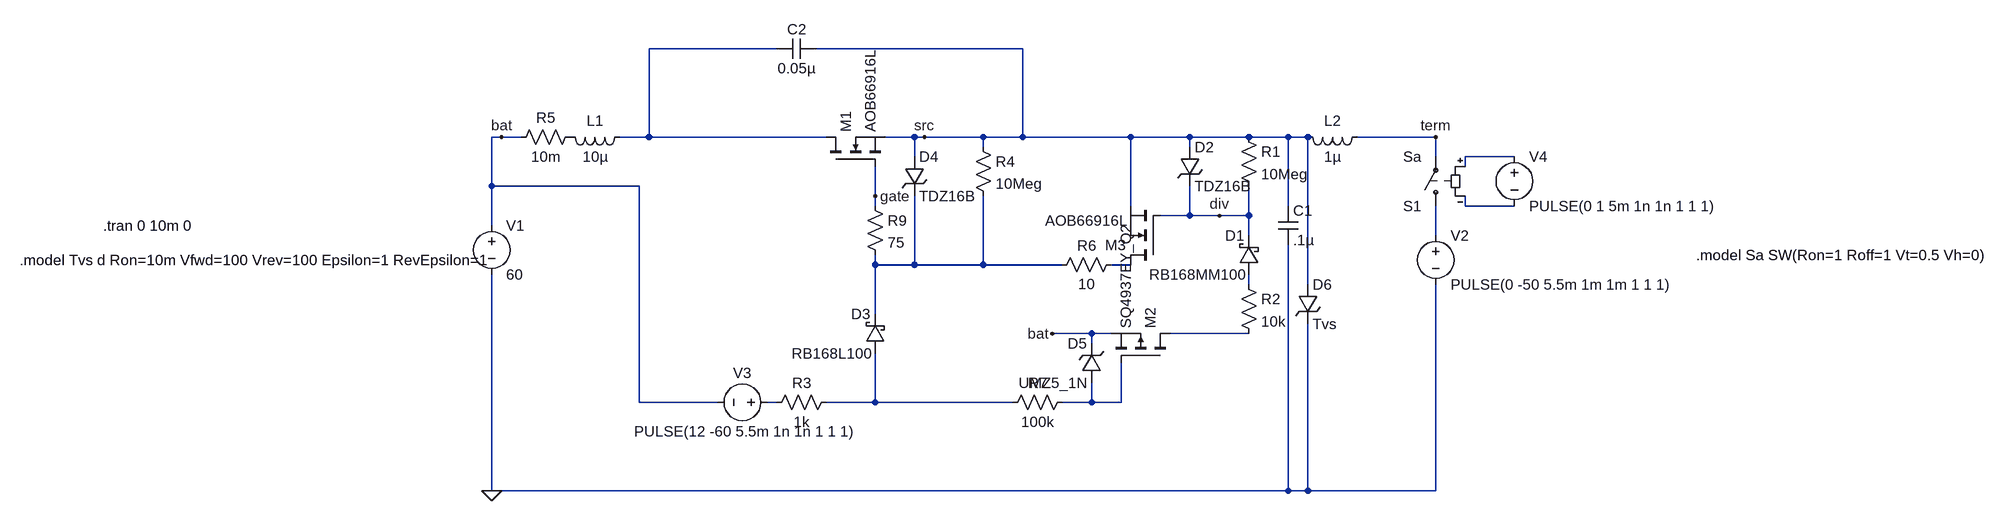
[diagram p0: schematic FET Driver rev4_testing_with_longer_short_time.asc]
FET Driver rev4_testing_with_longer_short_time.asc, the LTspice schematic file:
Version 4
SHEET 1 1884 732
WIRE 0 -112 -208 -112
WIRE 400 -112 64 -112
WIRE -448 32 -464 32
WIRE -416 32 -448 32
WIRE -208 32 -208 -112
WIRE -208 32 -256 32
WIRE 80 32 -208 32
WIRE 224 32 176 32
WIRE 240 32 224 32
WIRE 336 32 240 32
WIRE 400 32 400 -112
WIRE 400 32 336 32
WIRE 576 32 400 32
WIRE 672 32 576 32
WIRE 768 32 672 32
WIRE 832 32 768 32
WIRE 864 32 832 32
WIRE 1072 32 944 32
WIRE 336 48 336 32
WIRE 672 48 672 32
WIRE 224 64 224 32
WIRE 1072 64 1072 32
WIRE 1200 64 1120 64
WIRE 1120 80 1120 64
WIRE -464 112 -464 32
WIRE -224 112 -464 112
WIRE 160 128 160 80
WIRE 160 144 160 128
WIRE 576 144 576 32
WIRE 832 144 832 32
WIRE 1120 144 1120 128
WIRE 1200 144 1120 144
WIRE 672 160 672 112
WIRE 672 160 624 160
WIRE 720 160 672 160
WIRE 768 160 768 112
WIRE 768 160 720 160
WIRE -464 176 -464 112
WIRE 768 192 768 160
WIRE 1072 192 1072 144
WIRE 160 240 160 224
WIRE 224 240 224 128
WIRE 224 240 160 240
WIRE 336 240 336 128
WIRE 336 240 224 240
WIRE 464 240 336 240
WIRE 576 240 544 240
WIRE 768 272 768 256
WIRE 864 272 864 32
WIRE 160 320 160 240
WIRE 512 352 448 352
WIRE 544 352 512 352
WIRE 768 352 640 352
WIRE 512 368 512 352
WIRE -224 464 -224 112
WIRE -96 464 -224 464
WIRE 0 464 -16 464
WIRE 160 464 160 384
WIRE 160 464 80 464
WIRE 384 464 160 464
WIRE 512 464 512 432
WIRE 512 464 464 464
WIRE 560 464 560 400
WIRE 560 464 512 464
WIRE -464 608 -464 256
WIRE 832 608 832 208
WIRE 832 608 -464 608
WIRE 864 608 864 336
WIRE 864 608 832 608
WIRE 1072 608 1072 272
WIRE 1072 608 864 608
FLAG 720 160 div
FLAG 240 32 src
FLAG 160 128 gate
FLAG 1072 32 term
FLAG -464 608 0
FLAG -448 32 bat
FLAG 448 352 bat
SYMBOL nmos 80 80 R270
SYMATTR InstName M1
SYMATTR Value AOB66916L
SYMBOL voltage -464 160 R0
WINDOW 123 0 0 Left 0
WINDOW 39 0 0 Left 0
SYMATTR InstName V1
SYMATTR Value 60
SYMBOL voltage 1072 176 R0
WINDOW 123 0 0 Left 0
WINDOW 39 0 0 Left 0
SYMATTR InstName V2
SYMATTR Value PULSE(0 -50 5.5m 1m 1m 1 1 1)
SYMBOL res 752 16 R0
SYMATTR InstName R1
SYMATTR Value 10Meg
SYMBOL schottky 784 256 R180
WINDOW 0 24 64 Left 2
WINDOW 3 24 0 Left 2
SYMATTR InstName D1
SYMATTR Value RB168MM100
SYMATTR Description Diode
SYMATTR Type diode
SYMBOL res 752 256 R0
SYMATTR InstName R2
SYMATTR Value 10k
SYMBOL zener 656 48 R0
SYMATTR InstName D2
SYMATTR Value TDZ16B
SYMATTR Description Diode
SYMATTR Type diode
SYMBOL sw 1072 160 R180
SYMATTR InstName S1
SYMATTR Value Sa
SYMBOL voltage 1200 48 R0
WINDOW 123 0 0 Left 0
WINDOW 39 0 0 Left 0
SYMATTR InstName V4
SYMATTR Value PULSE(0 1 5m 1n 1n 1 1 1)
SYMBOL nmos 624 240 R180
SYMATTR InstName M3
SYMATTR Value AOB66916L
SYMBOL zener 208 64 R0
SYMATTR InstName D4
SYMATTR Value TDZ16B
SYMATTR Description Diode
SYMATTR Type diode
SYMBOL voltage 0 464 R90
WINDOW 0 -32 56 VBottom 2
WINDOW 3 32 56 VTop 2
WINDOW 123 0 0 Left 0
WINDOW 39 0 0 Left 0
SYMATTR InstName V3
SYMATTR Value PULSE(12 -60 5.5m 1n 1n 1 1 1)
SYMBOL res -320 16 R90
WINDOW 0 0 56 VBottom 2
WINDOW 3 32 56 VTop 2
SYMATTR InstName R5
SYMATTR Value 10m
SYMBOL res 560 224 R90
WINDOW 0 0 56 VBottom 2
WINDOW 3 32 56 VTop 2
SYMATTR InstName R6
SYMATTR Value 10
SYMBOL res 320 32 R0
SYMATTR InstName R4
SYMATTR Value 10Meg
SYMBOL schottky 176 384 R180
WINDOW 0 24 64 Left 2
WINDOW 3 24 0 Left 2
SYMATTR InstName D3
SYMATTR Value RB168L100
SYMATTR Description Diode
SYMATTR Type diode
SYMBOL res 96 448 R90
WINDOW 0 0 56 VBottom 2
WINDOW 3 32 56 VTop 2
SYMATTR InstName R3
SYMATTR Value 1k
SYMBOL TVSdiode 848 272 R0
SYMATTR InstName D6
SYMATTR Value Tvs
SYMBOL cap 816 144 R0
SYMATTR InstName C1
SYMATTR Value .1µ
SYMBOL cap 64 -128 R90
WINDOW 0 0 32 VBottom 2
WINDOW 3 32 32 VTop 2
SYMATTR InstName C2
SYMATTR Value 0.05µ
SYMBOL res 144 128 R0
SYMATTR InstName R9
SYMATTR Value 75
SYMBOL ind -240 16 R90
WINDOW 0 5 56 VBottom 2
WINDOW 3 32 56 VTop 2
SYMATTR InstName L1
SYMATTR Value 10µ
SYMBOL ind 960 16 R90
WINDOW 0 5 56 VBottom 2
WINDOW 3 32 56 VTop 2
SYMATTR InstName L2
SYMATTR Value 1µ
SYMBOL pmos 640 400 M270
SYMATTR InstName M2
SYMATTR Value SQ4937EY_Q2
SYMBOL res 480 448 R90
WINDOW 0 0 56 VBottom 2
WINDOW 3 32 56 VTop 2
SYMATTR InstName R7
SYMATTR Value 100k
SYMBOL zener 528 432 R180
WINDOW 0 24 64 Left 2
WINDOW 3 24 0 Left 2
SYMATTR InstName D5
SYMATTR Value UMZ5_1N
TEXT -1096 176 Left 2 !.tran 0 10m 0
TEXT 1496 224 Left 2 !.model Sa SW(Ron=1 Roff=1 Vt=0.5 Vh=0)
TEXT -1232 232 Left 2 !.model Tvs d Ron=10m Vfwd=100 Vrev=100 Epsilon=1 RevEpsilon=1

The netlist it stands for:
* FET Driver rev4_testing_with_longer_short_time.asc
M1 N001 gate src src AOB66916L
V1 bat 0 60
V2 N004 0 PULSE(0 -50 5.5m 1m 1m 1 1 1)
R1 src div 10Meg
D1 N007 div RB168MM100
R2 N007 N008 10k
D2 src div TDZ16B
S1 N004 term N002 N003 Sa
V4 N002 N003 PULSE(0 1 5m 1n 1n 1 1 1)
M3 N006 div src src AOB66916L
D4 src N005 TDZ16B
V3 N009 bat PULSE(12 -60 5.5m 1n 1n 1 1 1)
R5 P001 bat 10m
R6 N006 N005 10
R4 src N005 10Meg
D3 N010 N005 RB168L100
R3 N010 N009 1k
D6 src 0 Tvs
C1 src 0 .1µ
C2 src N001 0.05µ
R9 gate N005 75
L1 N001 P001 10µ
L2 term src 1µ
M2 N008 N011 bat bat SQ4937EY_Q2
R7 N011 N010 100k
D5 N011 bat UMZ5_1N
.model D D
.lib standard.dio
.model NMOS NMOS
.model PMOS PMOS
.lib standard.mos
.tran 0 10m 0
.model Sa SW(Ron=1 Roff=1 Vt=0.5 Vh=0)
.model Tvs d Ron=10m Vfwd=100 Vrev=100 Epsilon=1 RevEpsilon=1
.backanno
.end